# Altium schematic sheet CHIPBOY_Mk_II.SchDoc
size A; SheetNumber: 1; SheetTotal: 1
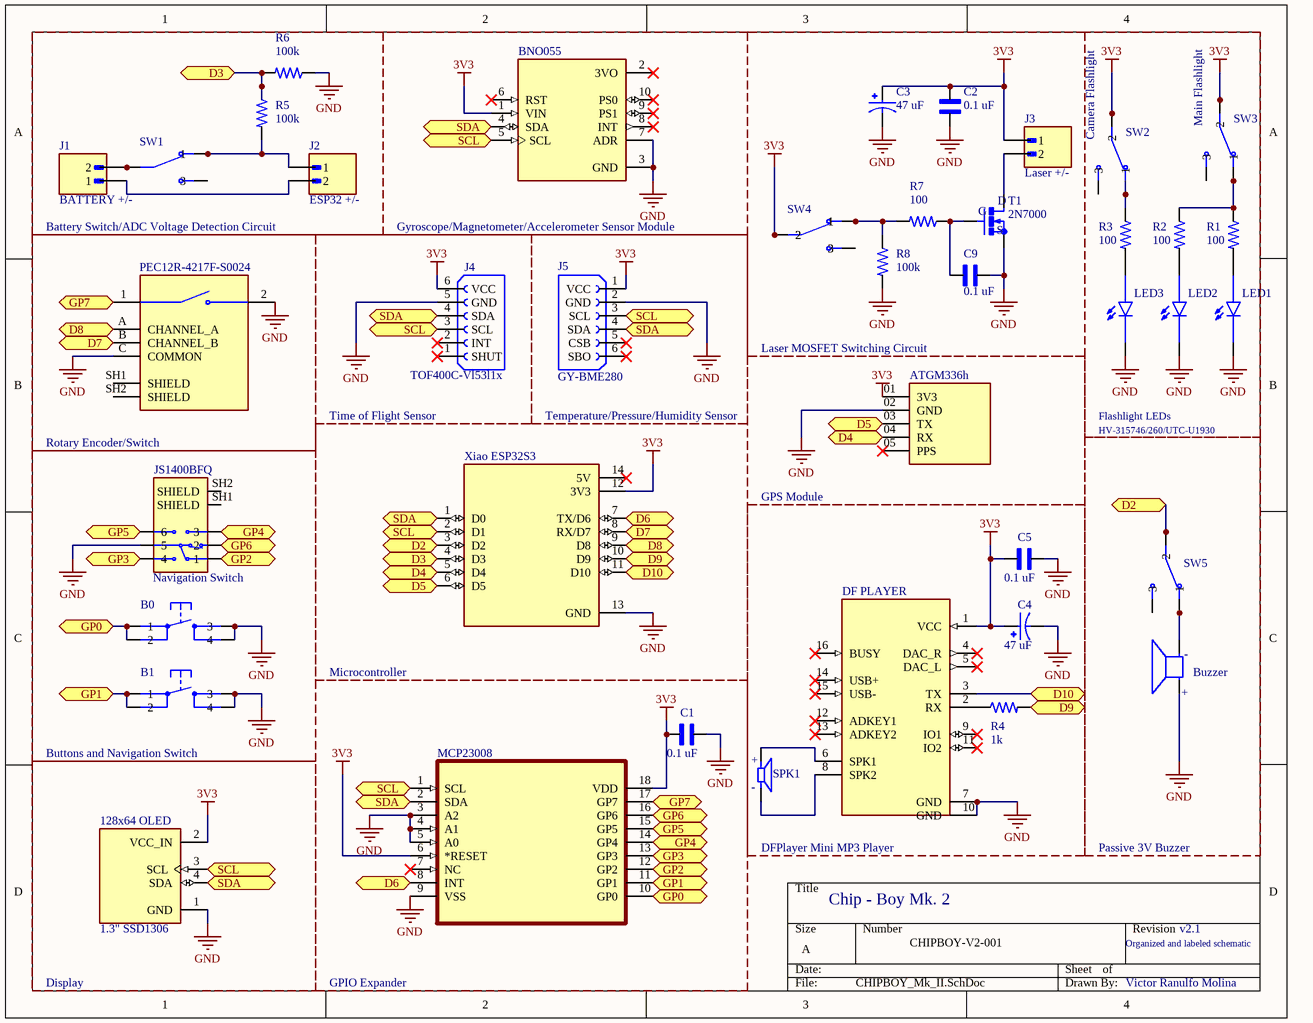
[diagram p0: CHIPBOY_Mk_II.SchDoc]

## Parts
128x64_OLED  1.3" SSD1306  [MODULE_DM-OLED096-636]
ATGM336h  ATGM336H  [SAMTEC_MTSW-105-07-L-S-240-LL]  (value not drawn)
B0  SKHHANA010  [SW_SKHHANA010]  (value not drawn)
B1  SKHHANA010  [SW_SKHHANA010]  (value not drawn)
BNO055  BNO055  [MODULE_2472]  (value not drawn)
Buzzer  (no value)  [CUI_CMI-1295IC-0385T]
C1  0.1 uF  [CAPRB250W50L450T300H550]
C2  0.1 uF  [CAPRB250W50L450T300H550]
C3  47 uF  [CAP_EEETPV470XAV]
C4  47 uF  [CAP_EEETPV470XAV]
C5  0.1 uF  [CAPRB250W50L450T300H550]
C9  0.1 uF  [CAPRB250W50L450T300H550]
DF_PLAYER  DFPLAYER  [MODULE_DFR0299]  (value not drawn)
GY-BME280  J5  [SULLINS_PPTC061LFBN-RC]
J1  BATTERY +/-  [HARWIN_M20-9990246]
J2  ESP32 +/-  [HARWIN_M20-9990246]
J3  Laser +/-  [HARWIN_M20-9990246]
LED1  led_through_hole  [LED_WP7113ID]  (value not drawn)
LED2  led_through_hole  [LED_WP7113ID]  (value not drawn)
LED3  led_through_hole  [LED_WP7113ID]  (value not drawn)
MCP23008  gpio extender  [DIP254P762X533-18]  (value not drawn)
Navigation_Switch  JS1400BFQ  [SW_JS1400BFQ]
PEC12R-4217F-S0024  rotary encoder  [XDCR_PEC12R-4217F-S0024]  (value not drawn)
R1  100  [RESAD640W45L370D200]
R2  100  [RESAD640W45L370D200]
R3  100  [RESAD640W45L370D200]
R4  1k  [RESAD640W45L370D200]
R5  100k  [RESAD640W45L370D200]
R6  100k  [RESAD640W45L370D200]
R7  100  [RESAD640W45L370D200]
R8  100k  [RESAD640W45L370D200]
SPK1  15mm speaker  [SPKR_CVS-1508]  (value not drawn)
SW1  switch top actuated  [SW_MHSS1104]  (value not drawn)
SW2  Camera Flashlight  [SW_MHSS1104]
SW3  Main Flashlight  [SW_MHSS1104]
SW4  switch top actuated  [SW_MHSS1104]  (value not drawn)
SW5  switch top actuated  [SW_MHSS1104]  (value not drawn)
T1  2N7000  [TO92]
TOF400C-Vl53l1x  J4  [SULLINS_PPTC061LFBN-RC]
Xiao_ESP32S3  (no value)  [MODULE_113991254]

## Blocks framed on the sheet
Battery Switch/ADC Voltage Detection Circuit: J1 J2 R5 R6 SW1
Gyroscope/Magnetometer/Accelerometer Sensor Module: BNO055
Laser MOSFET Switching Circuit: C2 C3 C9 J3 R7 R8 SW4 T1
Flashlight LEDs: LED1-LED3 R1-R3 SW2 SW3
Temperature/Pressure/Humidity Sensor: GY-BME280
Passive 3V Buzzer: Buzzer SW5

## Ports
D2 (bidir, see CHIPBOY_Mk_II[2C]), D2 (bidir, see CHIPBOY_Mk_II[4B]), D3 (bidir, see CHIPBOY_Mk_II[1A]), D3 (bidir, see CHIPBOY_Mk_II[2C]), D4 (bidir, see CHIPBOY_Mk_II[2C]), D4 (bidir, see CHIPBOY_Mk_II[3B]), D5 (bidir, see CHIPBOY_Mk_II[2C]), D5 (bidir, see CHIPBOY_Mk_II[3B]), D6 (bidir, see CHIPBOY_Mk_II[2C]), D6 (bidir, see CHIPBOY_Mk_II[2D]), D7 (bidir, see CHIPBOY_Mk_II[1B]), D7 (bidir, see CHIPBOY_Mk_II[2C]), D8 (bidir, see CHIPBOY_Mk_II[1B]), D8 (bidir, see CHIPBOY_Mk_II[2C]), D9 (bidir, see CHIPBOY_Mk_II[2C]), D9 (bidir, see CHIPBOY_Mk_II[4C]), D10 (bidir, see CHIPBOY_Mk_II[2C]), D10 (bidir, see CHIPBOY_Mk_II[4C]), GP0 (bidir, see CHIPBOY_Mk_II[1C]), GP0 (bidir, see CHIPBOY_Mk_II[3D]), GP1 (bidir, see CHIPBOY_Mk_II[1C]), GP1 (bidir, see CHIPBOY_Mk_II[3D]), GP2 (bidir, see CHIPBOY_Mk_II[1C]), GP2 (bidir, see CHIPBOY_Mk_II[3D]), GP3 (bidir, see CHIPBOY_Mk_II[1C]), GP3 (bidir, see CHIPBOY_Mk_II[3D]), GP4 (bidir, see CHIPBOY_Mk_II[1C]), GP4 (bidir, see CHIPBOY_Mk_II[3D]), GP5 (bidir, see CHIPBOY_Mk_II[1C]), GP5 (bidir, see CHIPBOY_Mk_II[3D]), GP6 (bidir, see CHIPBOY_Mk_II[1C]), GP6 (bidir, see CHIPBOY_Mk_II[3D]), GP7 (bidir, see CHIPBOY_Mk_II[1B]), GP7 (bidir, see CHIPBOY_Mk_II[3D]), SCL (bidir, see CHIPBOY_Mk_II[1D], CHIPBOY_Mk_II[2A], CHIPBOY_Mk_II[2B], CHIPBOY_Mk_II[2C]), SCL (bidir, see CHIPBOY_Mk_II[1D], CHIPBOY_Mk_II[2A], CHIPBOY_Mk_II[2B], CHIPBOY_Mk_II[2C], CHIPBOY_Mk_II[2D]), SCL (bidir, see CHIPBOY_Mk_II[1D], CHIPBOY_Mk_II[2A], CHIPBOY_Mk_II[2B], CHIPBOY_Mk_II[2D]), SCL (bidir, see CHIPBOY_Mk_II[1D], CHIPBOY_Mk_II[2B], CHIPBOY_Mk_II[2C], CHIPBOY_Mk_II[2D]), SCL (bidir, see CHIPBOY_Mk_II[2A], CHIPBOY_Mk_II[2B], CHIPBOY_Mk_II[2C], CHIPBOY_Mk_II[2D]), SDA (bidir, see CHIPBOY_Mk_II[1D], CHIPBOY_Mk_II[2A], CHIPBOY_Mk_II[2B], CHIPBOY_Mk_II[2C]), SDA (bidir, see CHIPBOY_Mk_II[1D], CHIPBOY_Mk_II[2A], CHIPBOY_Mk_II[2B], CHIPBOY_Mk_II[2C], CHIPBOY_Mk_II[2D]), SDA (bidir, see CHIPBOY_Mk_II[1D], CHIPBOY_Mk_II[2A], CHIPBOY_Mk_II[2B], CHIPBOY_Mk_II[2D]), SDA (bidir, see CHIPBOY_Mk_II[1D], CHIPBOY_Mk_II[2B], CHIPBOY_Mk_II[2C], CHIPBOY_Mk_II[2D]), SDA (bidir, see CHIPBOY_Mk_II[2A], CHIPBOY_Mk_II[2B], CHIPBOY_Mk_II[2C], CHIPBOY_Mk_II[2D])

## Nets
3V3: 128x64_OLED.2(VCC_IN) ATGM336h.01(3V3) BNO055.1(VIN) C1.1 C2.1 C3.1 C4.1 C5.1 DF_PLAYER.1(VCC) GY-BME280.1(VCC) J3.1 MCP23008.6(*RESET) MCP23008.18(VDD) SW2.3(2) SW2.4 SW3.3(2) SW3.4 SW4.3(2) SW4.4(2) TOF400C-Vl53l1x.6(VCC) Xiao_ESP32S3.12(3V3)
GND: 128x64_OLED.1(GND) ATGM336h.02(GND) B0.3 B0.4 B1.3 B1.4 BNO055.3(GND) BNO055.7(ADR) Buzzer.P C1.2 C2.2 C3.2 C4.2 C5.2 C9.1 DF_PLAYER.7(GND) DF_PLAYER.10(GND) GY-BME280.2(GND) LED1.C LED2.C LED3.C MCP23008.3(A2) MCP23008.4(A1) MCP23008.5(A0) MCP23008.9(VSS) Navigation_Switch.5 PEC12R-4217F-S0024.2 PEC12R-4217F-S0024.C(COMMON) R6.1 R8.2 T1.3(S) TOF400C-Vl53l1x.5(GND) Xiao_ESP32S3.13(GND)
D2: SW5.3(2) SW5.4 Xiao_ESP32S3.3(D2) ; port D2
D3: R5.1 R6.2 Xiao_ESP32S3.4(D3) ; port D3
D4: ATGM336h.04(RX) Xiao_ESP32S3.5(D4) ; port D4
D5: ATGM336h.03(TX) Xiao_ESP32S3.6(D5) ; port D5
D6: MCP23008.8(INT) Xiao_ESP32S3.7(TX/D6) ; port D6
D7: PEC12R-4217F-S0024.B(CHANNEL_B) Xiao_ESP32S3.8(RX/D7) ; port D7
D8: PEC12R-4217F-S0024.A(CHANNEL_A) Xiao_ESP32S3.9(D8) ; port D8
D9: R4.2 Xiao_ESP32S3.10(D9) ; port D9
D10: DF_PLAYER.3(TX) Xiao_ESP32S3.11(D10) ; port D10
GP0: B0.1 B0.2 MCP23008.10(GP0) ; port GP0
GP1: B1.1 B1.2 MCP23008.11(GP1) ; port GP1
GP2: MCP23008.12(GP2) Navigation_Switch.1 ; port GP2
GP3: MCP23008.13(GP3) Navigation_Switch.4 ; port GP3
GP4: MCP23008.14(GP4) Navigation_Switch.3 ; port GP4
GP5: MCP23008.15(GP5) Navigation_Switch.6 ; port GP5
GP6: MCP23008.16(GP6) Navigation_Switch.2 ; port GP6
GP7: MCP23008.17(GP7) PEC12R-4217F-S0024.1 ; port GP7
SCL: 128x64_OLED.3(SCL) BNO055.5(SCL) GY-BME280.3(SCL) MCP23008.1(SCL) TOF400C-Vl53l1x.3(SCL) Xiao_ESP32S3.2(D1) ; port SCL
SDA: 128x64_OLED.4(SDA) BNO055.4(SDA) GY-BME280.4(SDA) MCP23008.2(SDA) TOF400C-Vl53l1x.4(SDA) Xiao_ESP32S3.1(D0) ; port SDA
NetBuzzer_N: Buzzer.N SW5.1 SW5.2
NetC9_2: C9.2 R7.1 T1.2(G)
NetDF_PLAYER_2: DF_PLAYER.2(RX) R4.1
NetDF_PLAYER_6: DF_PLAYER.6(SPK1) SPK1.P
NetDF_PLAYER_8: DF_PLAYER.8(SPK2) SPK1.M
NetJ1_1: J1.1 J2.2
NetJ1_2: J1.2 SW1.3 SW1.4
NetJ2_1: J2.1 R5.2 SW1.1 SW1.2
NetJ3_2: J3.2 T1.1(D)
NetLED1_A: LED1.A R1.2
NetLED2_A: LED2.A R2.2
NetLED3_A: LED3.A R3.2
NetR1_1: R1.1 R2.1 SW3.1 SW3.2
NetR3_1: R3.1 SW2.1 SW2.2
NetR7_2: R7.2 R8.1 SW4.1 SW4.2(1)
NetSW1_5: SW1.5(3) SW1.6
NetSW2_5: SW2.5(3) SW2.6
NetSW3_5: SW3.5(3) SW3.6
NetSW4_5: SW4.5(3) SW4.6(3)
NetSW5_5: SW5.5(3) SW5.6

Not connected (* = marked no-connect by the designer): ATGM336h 05(PPS)*; BNO055 2(3VO)* 6(RST)* 8(INT)* 9(PS1)* 10(PS0)*; DF_PLAYER 4(DAC_R)* 5(DAC_L)* 9(IO1)* 11(IO2)* 12(ADKEY1)* 13(ADKEY2)* 14(USB+)* 15(USB-)* 16(BUSY)*; GY-BME280 5(CSB)* 6(SBO)*; MCP23008 7(NC)*; Navigation_Switch SH1(SHIELD) SH2(SHIELD); PEC12R-4217F-S0024 SH1(SHIELD) SH2(SHIELD); TOF400C-Vl53l1x 1(SHUT)* 2(INT)*; Xiao_ESP32S3 14(5V)*

## Notes on the sheet
- Time of Flight Sensor
- HV-315746/260/UTC-U1930
- Rotary Encoder/Switch
- GPS Module
- Microcontroller
- (near B1) Buttons and Navigation Switch
- (near DF_PLAYER) DFPlayer Mini MP3 Player
- Chip - Boy Mk. 2
- CHIPBOY-V2-001
- Organized and labeled schematic
- v2.1
- Display
- GPIO Expander
- Victor Ranulfo Molina
- (in symbol 15mm speaker) +; -
- (in symbol Buzzer_3V) -; +

## Library data of the parts
128x64_OLED = DM-OLED096-636
ATGM336h = 5 pin header
Buzzer = Buzzer_3V
C1 C2 C5 C9 = 0_1uF100V_CAP_FA14X7R2A104KNU00
C3 C4 = 47uF_SMD
GY-BME280 TOF400C-Vl53l1x = PPTC061LFBNRC
J1-J3 = 2_pin_header
Navigation_Switch = nav switch
R1-R8 = resistor_through_hole
SW2 SW3 = switch top actuated
T1 = mosfet
Xiao_ESP32S3 = xiao_esp32